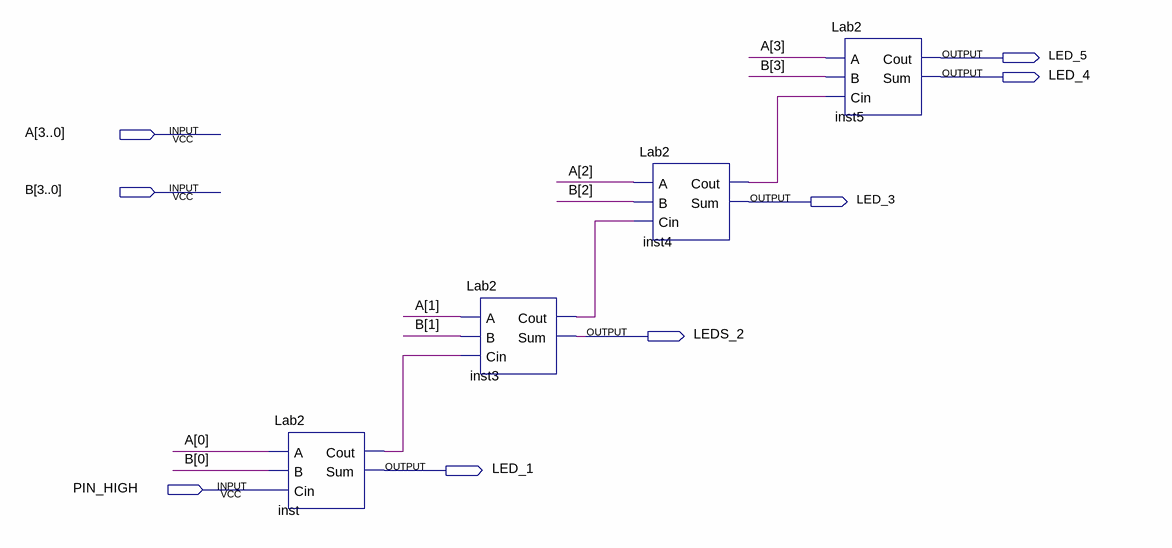
[diagram p0: schematic sheet]
// Quartus schematic four_bit_adder.bdf as structural Verilog: 4 symbols, 8 pins
module four_bit_adder (
  input  [3:0] A,
  input  [3:0] B,
  input  PIN_HIGH,
  output LED_5,
  output LED_4,
  output LED_3,
  output LEDS_2,
  output LED_1
);

  wire inst3_cout, inst4_cout, inst_cout;

  Lab2 inst (.A(A[0]), .B(B[0]), .Cin(PIN_HIGH), .Cout(inst_cout), .Sum(LED_1));
  Lab2 inst3 (.A(A[1]), .B(B[1]), .Cin(inst_cout), .Cout(inst3_cout), .Sum(LEDS_2));
  Lab2 inst4 (.A(A[2]), .B(B[2]), .Cin(inst3_cout), .Cout(inst4_cout), .Sum(LED_3));
  Lab2 inst5 (.A(A[3]), .B(B[3]), .Cin(inst4_cout), .Cout(LED_5), .Sum(LED_4));
endmodule
